# Altium schematic sheet LB77_proto.SchDoc
size 420 x 297 mm; SheetNumber: 1; SheetTotal: 1
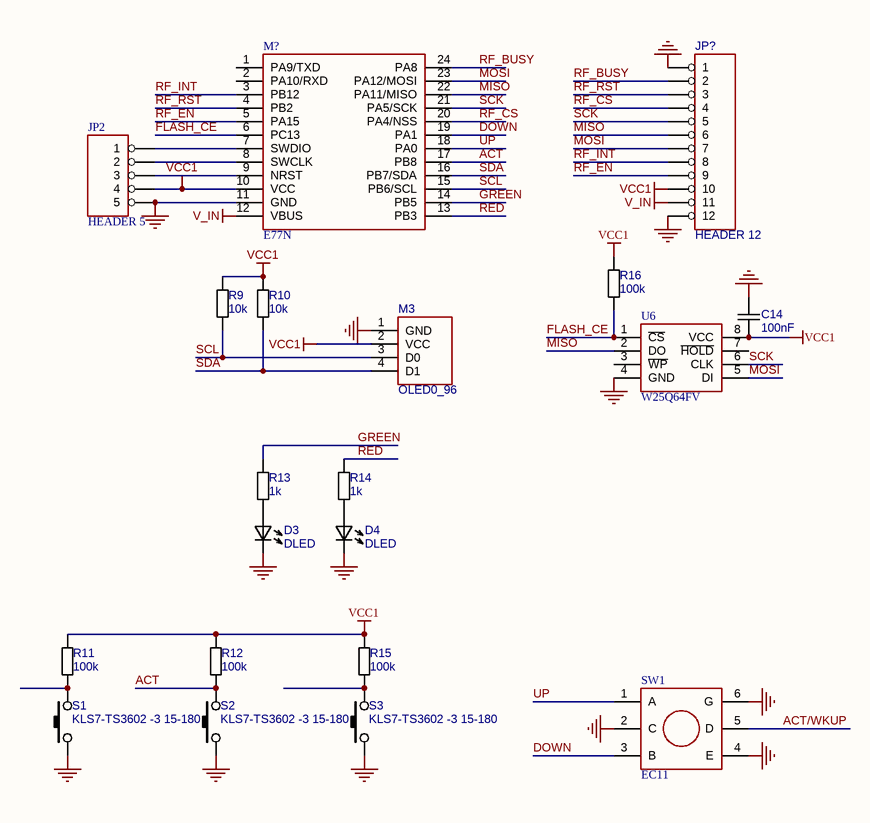
[diagram p0: LB77_proto.SchDoc]

## Parts
C14  100nF  [C-0603]
D3  DLED  [LED_3mm_RED]
D4  DLED  [LED_3mm_RED]
JP2  HEADER 5  [PLS1-5]
JP?  HEADER 12  [PLS1-12R_1]
M3  OLED0_96  [OLED096_I2C]
M?  E77N  [E77N]
R9  10k  [R-0603]
R10  10k  [R-0603]
R11  100k  [R-0603]
R12  100k  [R-0603]
R13  1k  [R-0603]
R14  1k  [R-0603]
R15  100k  [R-0603]
R16  100k  [R-0603]
S1  KLS7-TS3602 -3 15-180  [KN_MIN]
S2  KLS7-TS3602 -3 15-180  [KN_MIN]
S3  KLS7-TS3602 -3 15-180  [KN_MIN]
SW1  EC11  [EC11]
U6  W25Q64FV  [SOIC8-208]

## Nets
GND: C14.1 D3.2 D4.2 JP2.5 JP?.1 JP?.12 M3.1(GND) M?.11(GND) S1.1 S2.1 S3.1 SW1.2(C) SW1.4(E) SW1.6(G) U6.4(GND)
V_IN: JP?.11 M?.12(VBUS)
VCC1: C14.2 JP2.4 JP?.10 M3.2(VCC) M?.10(VCC) R9.2 R10.2 R11.2 R12.2 R15.2 R16.2 U6.8(VCC)
ACT: M?.17(PB8) R12.1 S2.2
ACT/WKUP: SW1.5(D)
DOWN: M?.19(PA1) SW1.3(B)
FLASH_CE: M?.6(PC13) R16.1 U6.1(~{CS})
GREEN: M?.14(PB5) R13.2
MISO: JP?.6 M?.22(PA11/MISO) U6.2(DO)
MOSI: JP?.7 M?.23(PA12/MOSI) U6.5(DI)
RED: M?.13(PB3) R14.2
RF_BUSY: JP?.2 M?.24(PA8)
RF_CS: JP?.4 M?.20(PA4/NSS)
RF_EN: JP?.9 M?.5(PA15)
RF_INT: JP?.8 M?.3(PB12)
RF_RST: JP?.3 M?.4(PB2)
SCK: JP?.5 M?.21(PA5/SCK) U6.6(CLK)
SCL: M3.3(D0) M?.15(PB6/SCL) R9.1
SDA: M3.4(D1) M?.16(PB7/SDA) R10.1
UP: M?.18(PA0) SW1.1(A)
NetD3_1: D3.1 R13.1
NetD4_1: D4.1 R14.1
NetJP2_1: JP2.1 M?.7(SWDIO)
NetJP2_2: JP2.2 M?.8(SWCLK)
NetJP2_3: JP2.3 M?.9(NRST)
NetR11_1: R11.1 S1.2
NetR15_1: R15.1 S3.2

Not connected (* = marked no-connect by the designer): M? 1(PA9/TXD) 2(PA10/RXD); U6 3(~{WP}) 7(~{HOLD})

## Notes on the sheet
- THIS DOCUMENT AND THE DATA DISCLOSED HEREIN OR
- HEREWITH IS THE PROPERTY OF ALTIUM LIMITED AND MAY
- DWG NO:
- REVISION
- REV:
- DESCRIPTION
- DATE
- APPROVED
- BE FREELY DISTRIBUTED IN WHOLE. NO RIGHTS ARE
- RESERVED OR EXPRESS OR IMPLIED WARANTEE GIVEN.
- ENG:
- APPROVALS
- PROJECT
- DSN:
- CHK:
- REFERENCE DOCUMENTS
- PROJECT REVISION:
- TITLE
- DOCUMENT REVISION:
- DESIGN ITEM:
- BOM:
- FAB DWG:
- PCB DWG:
- ASSY DWG:
- SCALE:
- A3
- SIZE
- CAGE CODE
- FILE NAME
- DWG NO.
- SHEET
- OF
- REV

## Library data of the parts
C14 = CAPN: Voltage: 50V; Точність/група: NP0; Вид: Конденсатор
D3 D4 = DLED: Вид: Світлодіод
JP2 = HEADER 5: Вид: Роз'єм; *: *
JP? = HEADER 12: Вид: Роз'єм; *: *
M3 = OLED0_96_I2C
M? = E77N: E77 MBL clone; Вид: Мікросхема
R9-R16 = RES: Точність/група: 5%; Вид: Резистор
S1-S3 = SW-1: Вид: Кнопка; Робоча напруга: *
U6 = W25Q64FV: Вид: Мікросхема